# EAGLE design cube_atmega328 (EAGLE 7.5.0)
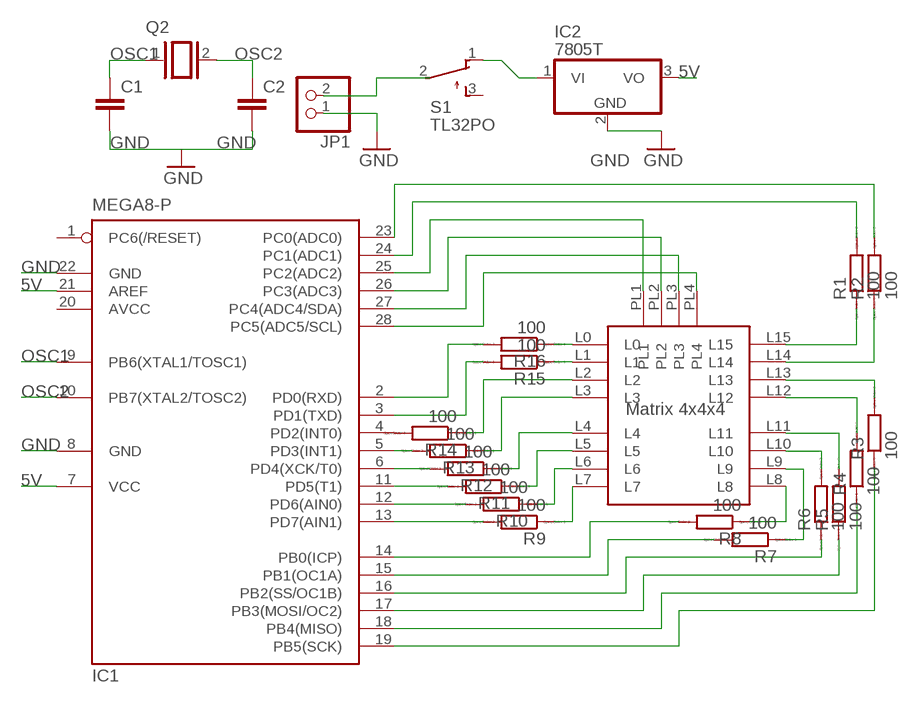
[diagram p0: schematic, sheet 1]

## Parts
C1  C5/2.5  [C5B2.5]
C2  C5/2.5  [C5B2.5]
IC1  MEGA8-P  [DIL28-3]
IC2  7805T  [TO220H]
JP1  PINHD-1X2  [1X02]
Q2  XTAL/S  [QS]
R1  100  R0207/10  [0207/10]
R2  100  R0207/10  [0207/10]
R3  100  R0207/10  [0207/10]
R4  100  R0207/10  [0207/10]
R5  100  R0207/10  [0207/10]
R6  100  R0207/10  [0207/10]
R7  100  R0207/10  [0207/10]
R8  100  R0207/10  [0207/10]
R9  100  R0207/10  [0207/10]
R10  100  R0207/10  [0207/10]
R11  100  R0207/10  [0207/10]
R12  100  R0207/10  [0207/10]
R13  100  R0207/10  [0207/10]
R14  100  R0207/10  [0207/10]
R15  100  R0207/10  [0207/10]
R16  100  R0207/10  [0207/10]
S1  TL32PO  [TL3XPO]
U$1  LC4X4X4  [LC4X4X4]

## Nets
5V: IC1.7(VCC) IC1.21(AREF) IC2.3(VO)
GND: C1.2 C2.2 IC1.8(GND) IC1.22(GND) IC2.2(GND) JP1.1
N$1: IC1.2(PD0(RXD)) R16.2
N$2: IC1.3(PD1(TXD)) R15.2
N$3: R14.1 U$1.L2
N$4: R13.1 U$1.L3
N$5: R12.1 U$1.L4
N$6: R11.1 U$1.L5
N$7: R10.1 U$1.L6
N$8: IC1.13(PD7(AIN1)) R9.2
N$9: IC1.14(PB0(ICP)) R8.2
N$10: IC1.15(PB1(OC1A)) R7.2
N$11: IC1.16(PB2(SS/OC1B)) R6.1
N$12: IC1.17(PB3(MOSI/OC2)) R5.1
N$13: IC1.18(PB4(MISO)) R4.1
N$14: IC1.19(PB5(SCK)) R3.1
N$15: IC1.23(PC0(ADC0)) R2.2
N$16: IC1.24(PC1(ADC1)) R1.2
N$17: IC1.25(PC2(ADC2)) U$1.PL1
N$18: IC1.26(PC3(ADC3)) U$1.PL2
N$19: IC1.27(PC4(ADC4/SDA)) U$1.PL3
N$20: IC1.28(PC5(ADC5/SCL)) U$1.PL4
N$21: R1.1 U$1.L15
N$22: R2.1 U$1.L14
N$23: R3.2 U$1.L13
N$24: R4.2 U$1.L12
N$25: R5.2 U$1.L11
N$26: R6.2 U$1.L10
N$27: R7.1 U$1.L9
N$28: R8.1 U$1.L8
N$29: R9.1 U$1.L7
N$30: IC1.12(PD6(AIN0)) R10.2
N$31: IC1.11(PD5(T1)) R11.2
N$32: IC1.6(PD4(XCK/T0)) R12.2
N$33: IC1.5(PD3(INT1)) R13.2
N$34: IC1.4(PD2(INT0)) R14.2
N$35: R15.1 U$1.L1
N$36: R16.1 U$1.L0
N$37: JP1.2
N$38: IC2.1(VI) S1.1(O)
OSC1: C1.1 IC1.9(PB6(XTAL1/TOSC1)) Q2.1
OSC2: C2.1 IC1.10(PB7(XTAL2/TOSC2)) Q2.2
Unconnected: IC1.1(PC6(/RESET)) S1.2(P) S1.3(S)

## Power pins joined to a net without a drawn wire
AVCC: IC1.20(AVCC)

## Library data of the parts
C1 C2 = capacitor-wima:C: CAPACITOR naming: grid - package width
IC1 = atmel:MEGA8-P: MICROCONTROLLER 8 Kbytes FLASH, 1 kbytes SRAM, 512 bytes EEPROM, USART, 4-channel 10 bit ADC, 2-channel 8 bit ADC Pin compatible with Atmega48, ATMega88, ATMega168 Source: avr.lbr; OC_FARNELL: unknown; OC_NEWARK: unknown
IC2 = linear:78*: Positive VOLTAGE REGULATOR Source: http://cache.national.com/ds/LM/LM78L05.pdf http://www.fairchildsemi.com/ds/LM/LM7805.pdf
JP1 = pinhead:PINHD-1X2: PIN HEADER
Q2 = special:XTAL/S: CRYSTAL
R1-R16 = eagle-ltspice:R: RESISTOR, European symbol; SPICEMODEL: NONE; SPICEPREFIX: R
S1 = switch:TL32PO: TINY SWITCH ON - MOM Source: http://www2.produktinfo.conrad.com/datenblaetter/700000-724999/705152-da-01-de-Subminiaturschalter_TL_36YO.pdf
U$1 = ledCube4x4x4v2:LC4X4X4

## Board
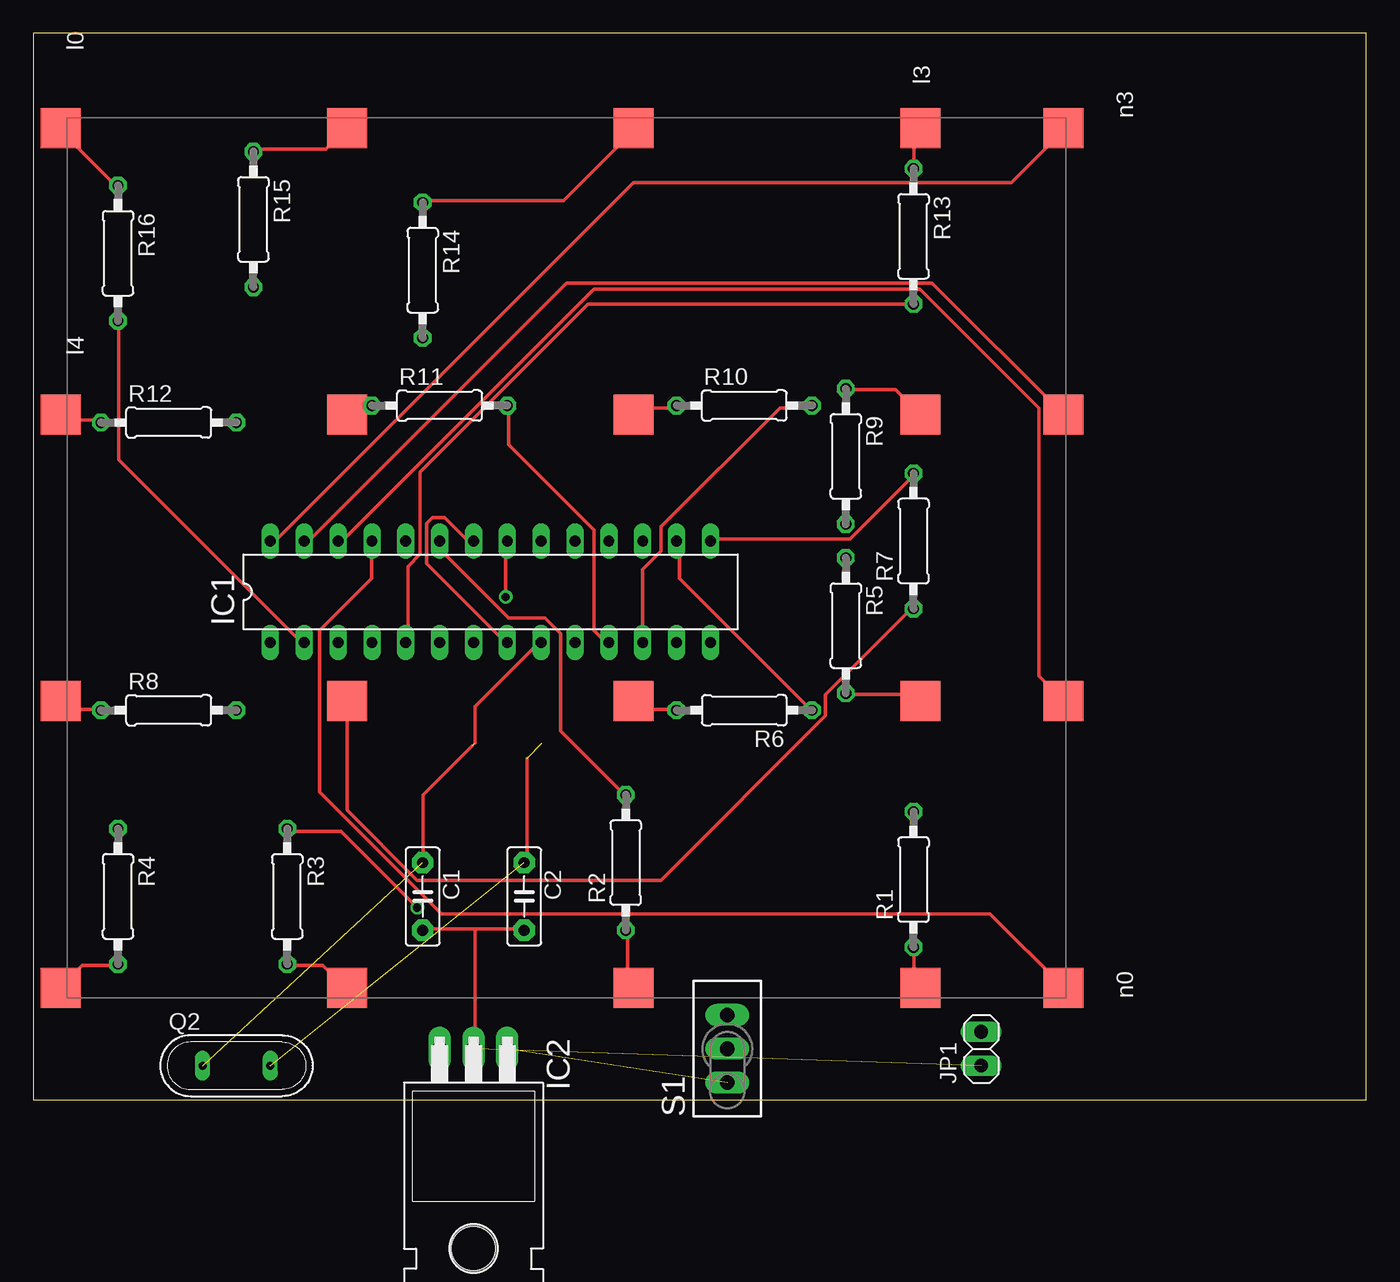
[diagram p1: board, top side]
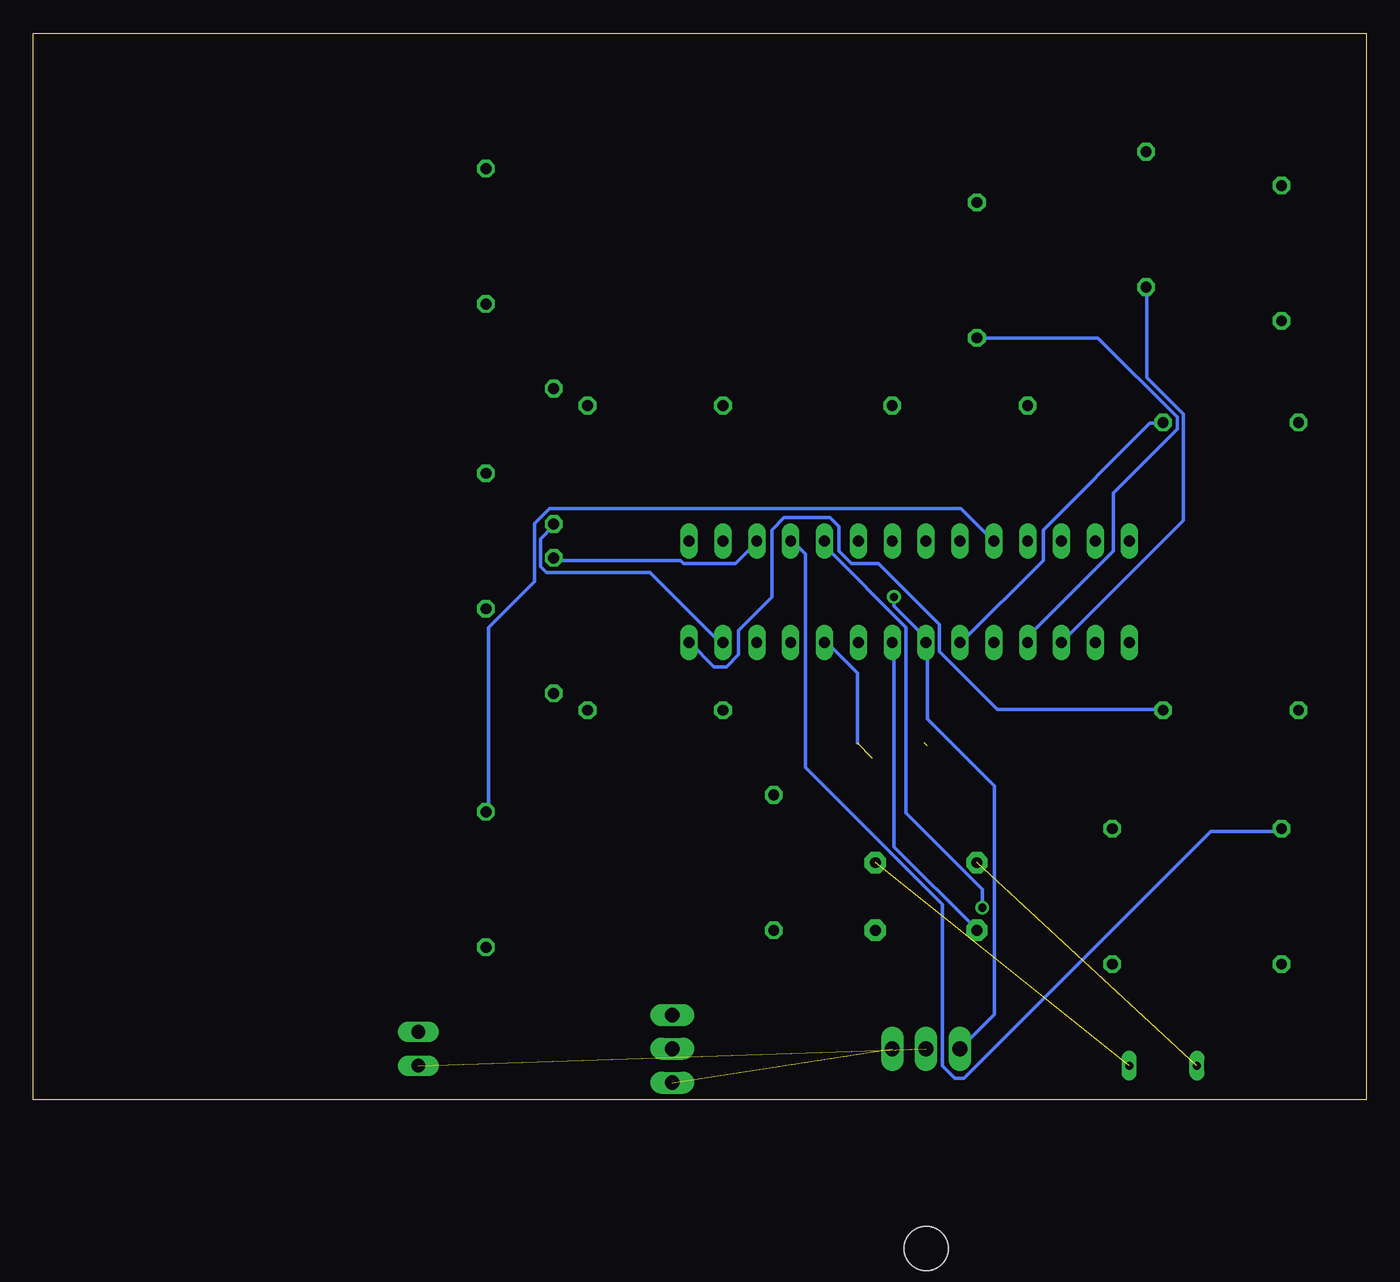
[diagram p2: board, bottom side, seen from below]

Size 100 x 80 mm. Coordinates in mm from the lower left corner, seen from the top.
Outline: 0,0 100,0 100,80 0,80 0,0
Copper layers (1*16): Top 0.035mm / dielectric 1.5mm / Bottom 0.035mm
Design rules "default": minimum track width 10mil, minimum drill 24mil, track to track 8mil, track to pad 8mil, pad to pad 8mil, via to via 8mil, smd to smd 8mil, copper to edge 40mil, drill to drill 8mil, minimum pad ring 10mil, minimum via ring 8mil, stop-mask expansion 4mil, vias tented up to drill 0mil, thermal gap 10mil

### Footprints (pad centres in the part's own frame; a part is rotated, then mirrored left to right if it is on the bottom)
C5B2.5 = drill 0.813 pad 1.6 octagon: 1 -2.54,0; 2 2.54,0
DIL28-3 = drill 0.813 long: 1 -16.51,-3.81; 2 -13.97,-3.81; 3 -11.43,-3.81; 4 -8.89,-3.81; 5 -6.35,-3.81; 6 -3.81,-3.81; 7 -1.27,-3.81; 8 1.27,-3.81; 9 3.81,-3.81; 10 6.35,-3.81; 11 8.89,-3.81; 12 11.43,-3.81; 13 13.97,-3.81; 14 16.51,-3.81; 15 16.51,3.81; 16 13.97,3.81; 17 11.43,3.81; 18 8.89,3.81; 19 6.35,3.81; 20 3.81,3.81; 21 1.27,3.81; 22 -1.27,3.81; 23 -3.81,3.81; 24 -6.35,3.81; 25 -8.89,3.81; 26 -11.43,3.81; 27 -13.97,3.81; 28 -16.51,3.81
TO220H = drill 1.118 long: 1 -2.54,-10.16; 2 0,-10.16; 3 2.54,-10.16 | hole 3.302: 0,4.826
1X02 = drill 1.016 long: 1 -1.27,0; 2 1.27,0
QS = drill 0.61 long: 1 -2.54,0; 2 2.54,0
0207/10 = drill 0.813 octagon: 1 -5.08,0; 2 5.08,0
TL3XPO = drill 1.1 pad 1.422 long: 1 -2.54,0; 2 0,0; 3 2.54,0
LC4X4X4 = smd 3 x 3: L0 32.25,32.25; L1 32.25,10.75; L2 32.25,-10.75; L3 32.25,-32.25; L4 10.75,32.25; L5 10.75,10.75; L6 10.75,-10.75; L7 10.75,-32.25; L8 -10.75,32.25; L9 -10.75,10.75; L10 -10.75,-10.75; L11 -10.75,-32.25; L12 -32.25,32.25; L13 -32.25,10.75; L14 -32.25,-10.75; L15 -32.25,-32.25; PL1 -32.25,-43; PL2 -10.75,-43; PL3 10.75,-43; PL4 32.25,-43

### Placement (x,y rotation side)
C1  29.21,15.24 270 top
C2  36.83,15.24 270 top
IC1  34.29,38.1 0 top
IC2  33.02,-6.35 180 top
JP1  71.12,3.81 90 top
Q2  15.24,2.54 0 top
R1  66.04,16.51 90 top
R2  44.45,17.78 90 top
R3  19.05,15.24 270 top
R4  6.35,15.24 270 top
R5  60.96,35.56 270 top
R6  53.34,29.21 180 top
R7  66.04,41.91 90 top
R8  10.16,29.21 0 top
R9  60.96,48.26 270 top
R10  53.34,52.07 0 top
R11  30.48,52.07 0 top
R12  10.16,50.8 0 top
R13  66.04,64.77 270 top
R14  29.21,62.23 270 top
R15  16.51,66.04 270 top
R16  6.35,63.5 270 top
S1  52.07,3.81 90 top
U$1  34.29,40.64 90 top

### Tracks (layer width: path | path; a pad name or v marks a point on that pad's centre or on a via)
5V  (via drill 0.61)
  Top 0.254: v35.43,37.72 35.43,41.83 IC1.21
  Bottom 0.254: IC2.3 27.89,6.4 27.89,23.55 32.92,28.57 32.92,34.29 IC1.7 33.15,34.29 33.15,34.75 35.43,37.03 v35.43,37.72
GND  (1 unrouted)
  Top 0.254: IC1.22 32.92,42.06 32.46,42.06 30.86,43.66 29.95,43.66 29.49,43.2 29.49,40.23 35.43,34.29 IC1.8 | 33.15,12.8 36.8,12.8 C2.2 | 33.15,12.8 29.26,12.8 C1.2 | 33.15,12.8 33.15,3.89 IC2.2
  Bottom 0.254: IC1.8 35.43,34.29 35.43,18.97 29.26,12.8 C1.2
N$1
  Top 0.254: R16.2 6.4,58.29 6.4,48.01 20.12,34.29 IC1.2
N$2
  Bottom 0.254: IC1.3 13.72,43.43 13.72,51.44 16.46,54.18 16.46,60.81 R15.2
N$3
  Top 0.254: R14.1 29.26,67.44 39.78,67.44 45.03,72.69 U$1.L2
N$4
  Top 0.254: R13.1 66.06,69.95 66.06,72.24 66.52,72.69 U$1.L3
N$5
  Top 0.254: R12.1 5.03,50.98 2.29,50.98 2.06,51.21 U$1.L4
N$6
  Top 0.254: R11.1 25.38,51.89 24,51.89 23.55,51.44 U$1.L5
N$7
  Top 0.254: R10.1 48.23,51.89 45.72,51.89 45.26,51.44 U$1.L6
N$8
  Bottom 0.254: IC1.13 48.46,34.29 53.72,39.55 61.49,39.55 61.95,40.01 61.95,42.06 61.04,42.98 R9.2
N$9
  Bottom 0.254: R8.2 15.32,29.26 27.66,29.26 32,33.6 32,35.66 36.58,40.23 38.63,40.23 39.55,41.15 39.55,42.98 40.23,43.66 43.66,43.66 44.58,42.75 44.58,37.72 47.09,35.2 47.09,33.38 48.01,32.46 48.92,32.46 50.75,34.29 IC1.14
N$10
  Top 0.254: IC1.15 50.98,42.06 61.27,42.06 66.06,46.86 R7.2
N$11
  Top 0.254: IC1.16 48.46,41.83 48.46,39.09 58.29,29.26 R6.1
N$12
  Bottom 0.254: R5.1 60.81,40.46 51.44,40.46 51.21,40.23 47.32,40.23 45.72,41.83 IC1.17
N$13
  Bottom 0.254: R4.1 6.4,20.12 11.66,20.12 30.18,1.6 30.86,1.6 31.77,2.52 31.77,14.63 42.06,24.92 42.06,40.92 42.98,41.83 IC1.18
N$14  (via drill 0.61)
  Top 0.254: v28.8,14.4 23.09,20.12 19.2,20.12 R3.1
  Bottom 0.254: v28.8,14.4 28.8,15.77 34.52,21.49 34.52,35.43 40.46,41.38 40.46,41.83 IC1.19
N$15
  Top 0.254: IC1.23 30.63,41.83 30.63,41.15 35.66,36.12 38.41,36.12 39.55,34.98 39.55,27.66 44.35,22.86 R2.2
N$16
  Bottom 0.254: R1.2 65.84,21.72 65.84,35.43 62.41,38.86 62.41,43.2 61.27,44.35 30.4,44.35 28.12,42.06 IC1.24
N$17
  Top 0.254: IC1.25 25.38,41.83 25.38,39.09 21.49,35.2 21.49,23.09 30.63,13.95 71.78,13.95 77.27,8.46 U$1.PL1
N$18
  Top 0.254: IC1.26 22.86,42.06 23.32,42.06 42.06,60.81 66.52,60.81 75.44,51.89 75.44,31.77 77.27,29.95 U$1.PL2
N$19
  Top 0.254: IC1.27 20.34,42.06 20.8,42.06 40.01,61.27 67.44,61.27 77.27,51.44 U$1.PL3
N$20
  Top 0.254: IC1.28 17.83,42.06 18.29,42.06 45.03,68.81 73.38,68.81 77.27,72.69 U$1.PL4
N$21
  Top 0.254: R1.1 66.06,11.43 66.06,8.91 66.52,8.46 U$1.L15
N$22
  Top 0.254: R2.1 44.58,12.57 44.58,8.91 45.03,8.46 U$1.L14
N$23
  Top 0.254: R3.2 19.2,10.06 21.72,10.06 23.32,8.46 U$1.L13
N$24
  Top 0.254: R4.2 6.17,10.06 3.66,10.06 2.06,8.46 U$1.L12
N$25
  Top 0.254: R5.2 61.04,30.4 66.06,30.4 66.52,29.95 U$1.L11
N$26
  Top 0.254: R6.2 48.23,29.26 45.72,29.26 45.26,29.72 U$1.L10
N$27
  Top 0.254: R7.1 65.84,36.8 59.44,30.4 59.44,28.8 47.09,16.46 28.8,16.46 23.55,21.72 23.55,29.72 U$1.L9
N$28
  Top 0.254: R8.1 5.03,29.26 2.52,29.26 2.06,29.72 U$1.L8
N$29
  Top 0.254: R9.1 61.04,53.26 64.69,53.26 66.52,51.44 U$1.L7
N$30
  Top 0.254: IC1.12 45.72,39.78 47.09,41.15 47.09,42.98 56.01,51.89 58.29,51.89 R10.2
N$31
  Top 0.254: R11.2 35.66,51.89 35.66,49.15 42.06,42.75 42.06,35.2 42.98,34.29 IC1.11
N$32
  Bottom 0.254: R12.2 15.32,50.75 16.23,50.75 24.23,42.75 24.23,40.46 30.4,34.29 IC1.6
N$33
  Top 0.254: IC1.5 28.12,34.29 28.12,40.01 29.03,40.92 29.03,47.09 41.6,59.66 65.84,59.66 R13.2
N$34
  Bottom 0.254: R14.2 20.12,57.15 14.17,51.21 14.17,50.29 18.97,45.49 18.97,41.15 25.38,34.75 25.38,34.29 IC1.4
N$35
  Top 0.254: R15.1 16.69,71.32 21.95,71.32 23.32,72.69 U$1.L1
N$36
  Top 0.254: R16.1 6.17,68.58 2.06,72.69 U$1.L0
N$38  (1 unrouted)
OSC1  (2 unrouted)
  Top 0.254: 33.15,26.75 33.15,29.49 37.95,34.29 IC1.9 | 32.92,26.52 29.26,22.86 29.26,17.83 C1.1
OSC2  (2 unrouted)
  Top 0.254: 37.03,25.6 37.03,17.83 C2.1
  Bottom 0.254: 38.18,26.75 38.18,32 40.46,34.29 IC1.10